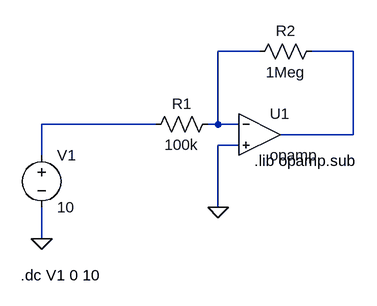
[diagram p0: schematic inverting_op_amp.asc]
inverting_op_amp.asc, the LTspice schematic file:
Version 4
SHEET 1 880 680
WIRE 272 96 208 96
WIRE 416 96 352 96
WIRE 112 208 -64 208
WIRE 208 208 208 96
WIRE 208 208 192 208
WIRE 240 208 208 208
WIRE 416 224 416 96
WIRE 416 224 304 224
WIRE 240 240 208 240
WIRE -64 256 -64 208
WIRE 208 336 208 240
WIRE -64 384 -64 336
FLAG 208 336 0
FLAG -64 384 0
SYMBOL voltage -64 240 R0
WINDOW 123 0 0 Left 0
WINDOW 39 0 0 Left 0
SYMATTR InstName V1
SYMATTR Value 10
SYMBOL res 208 192 R90
WINDOW 0 0 56 VBottom 2
WINDOW 3 32 56 VTop 2
SYMATTR InstName R1
SYMATTR Value 100k
SYMBOL res 368 80 R90
WINDOW 0 0 56 VBottom 2
WINDOW 3 32 56 VTop 2
SYMATTR InstName R2
SYMATTR Value 1Meg
SYMBOL OpAmps\\opamp 272 160 R0
SYMATTR InstName U1
TEXT 264 264 Left 2 !.lib opamp.sub
TEXT -96 440 Left 2 !.dc V1 0 10

The netlist it stands for:
* inverting_op_amp.asc
V1 N003 0 10
R1 N001 N003 100k
R2 N002 N001 1Meg
XU1 N001 0 N002 opamp Aol=100K GBW=10Meg  ; pins invin noninvin out
.lib opamp.sub
.dc V1 0 10
.backanno
.end